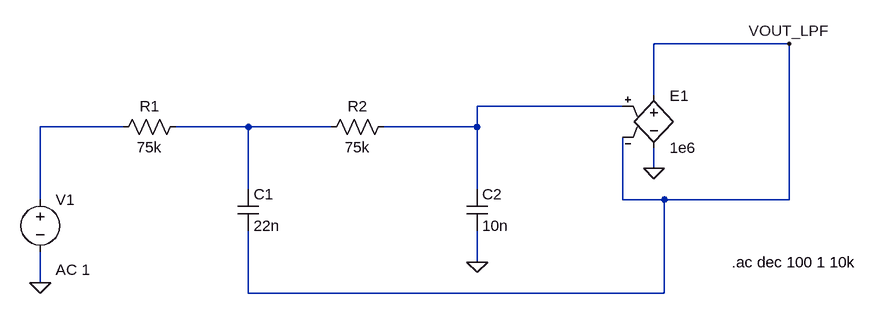
[diagram p0: schematic LPF_stage.asc]
LPF_stage.asc, the LTspice schematic file:
Version 4.1
SHEET 1 1488 680
WIRE 1248 -128 1040 -128
WIRE 1040 -48 1040 -128
WIRE 992 -32 768 -32
WIRE 224 0 96 0
WIRE 416 0 304 0
WIRE 544 0 416 0
WIRE 768 0 768 -32
WIRE 768 0 624 0
WIRE 1040 64 1040 32
WIRE 416 96 416 0
WIRE 768 96 768 0
WIRE 96 112 96 0
WIRE 992 112 992 16
WIRE 1056 112 992 112
WIRE 1248 112 1248 -128
WIRE 1248 112 1056 112
WIRE 768 208 768 160
WIRE 96 240 96 192
WIRE 416 256 416 160
WIRE 1056 256 1056 112
WIRE 1056 256 416 256
FLAG 96 240 0
FLAG 1040 64 0
FLAG 768 208 0
FLAG 1248 -128 VOUT_LPF
SYMBOL voltage 96 96 R0
WINDOW 123 24 124 Left 2
WINDOW 39 0 0 Left 0
SYMATTR Value2 AC 1
SYMATTR InstName V1
SYMATTR Value ""
SYMBOL res 320 -16 R90
WINDOW 0 0 56 VBottom 2
WINDOW 3 32 56 VTop 2
SYMATTR InstName R1
SYMATTR Value 75k
SYMBOL res 640 -16 R90
WINDOW 0 0 56 VBottom 2
WINDOW 3 32 56 VTop 2
SYMATTR InstName R2
SYMATTR Value 75k
SYMBOL e 1040 -64 R0
SYMATTR InstName E1
SYMATTR Value 1e6
SYMBOL cap 400 96 R0
SYMATTR InstName C1
SYMATTR Value 22n
SYMBOL cap 752 96 R0
SYMATTR InstName C2
SYMATTR Value 10n
TEXT 1160 208 Left 2 !.ac dec 100 1 10k

The netlist it stands for:
* LPF_stage.asc
V1 N002 0 AC 1
R1 N003 N002 75k
R2 N001 N003 75k
E1 VOUT_LPF 0 N001 VOUT_LPF 1e6
C1 N003 VOUT_LPF 22n
C2 N001 0 10n
.ac dec 100 1 10k
.backanno
.end